# Altium schematic sheet MachNguyenLy.SchDoc
size A2
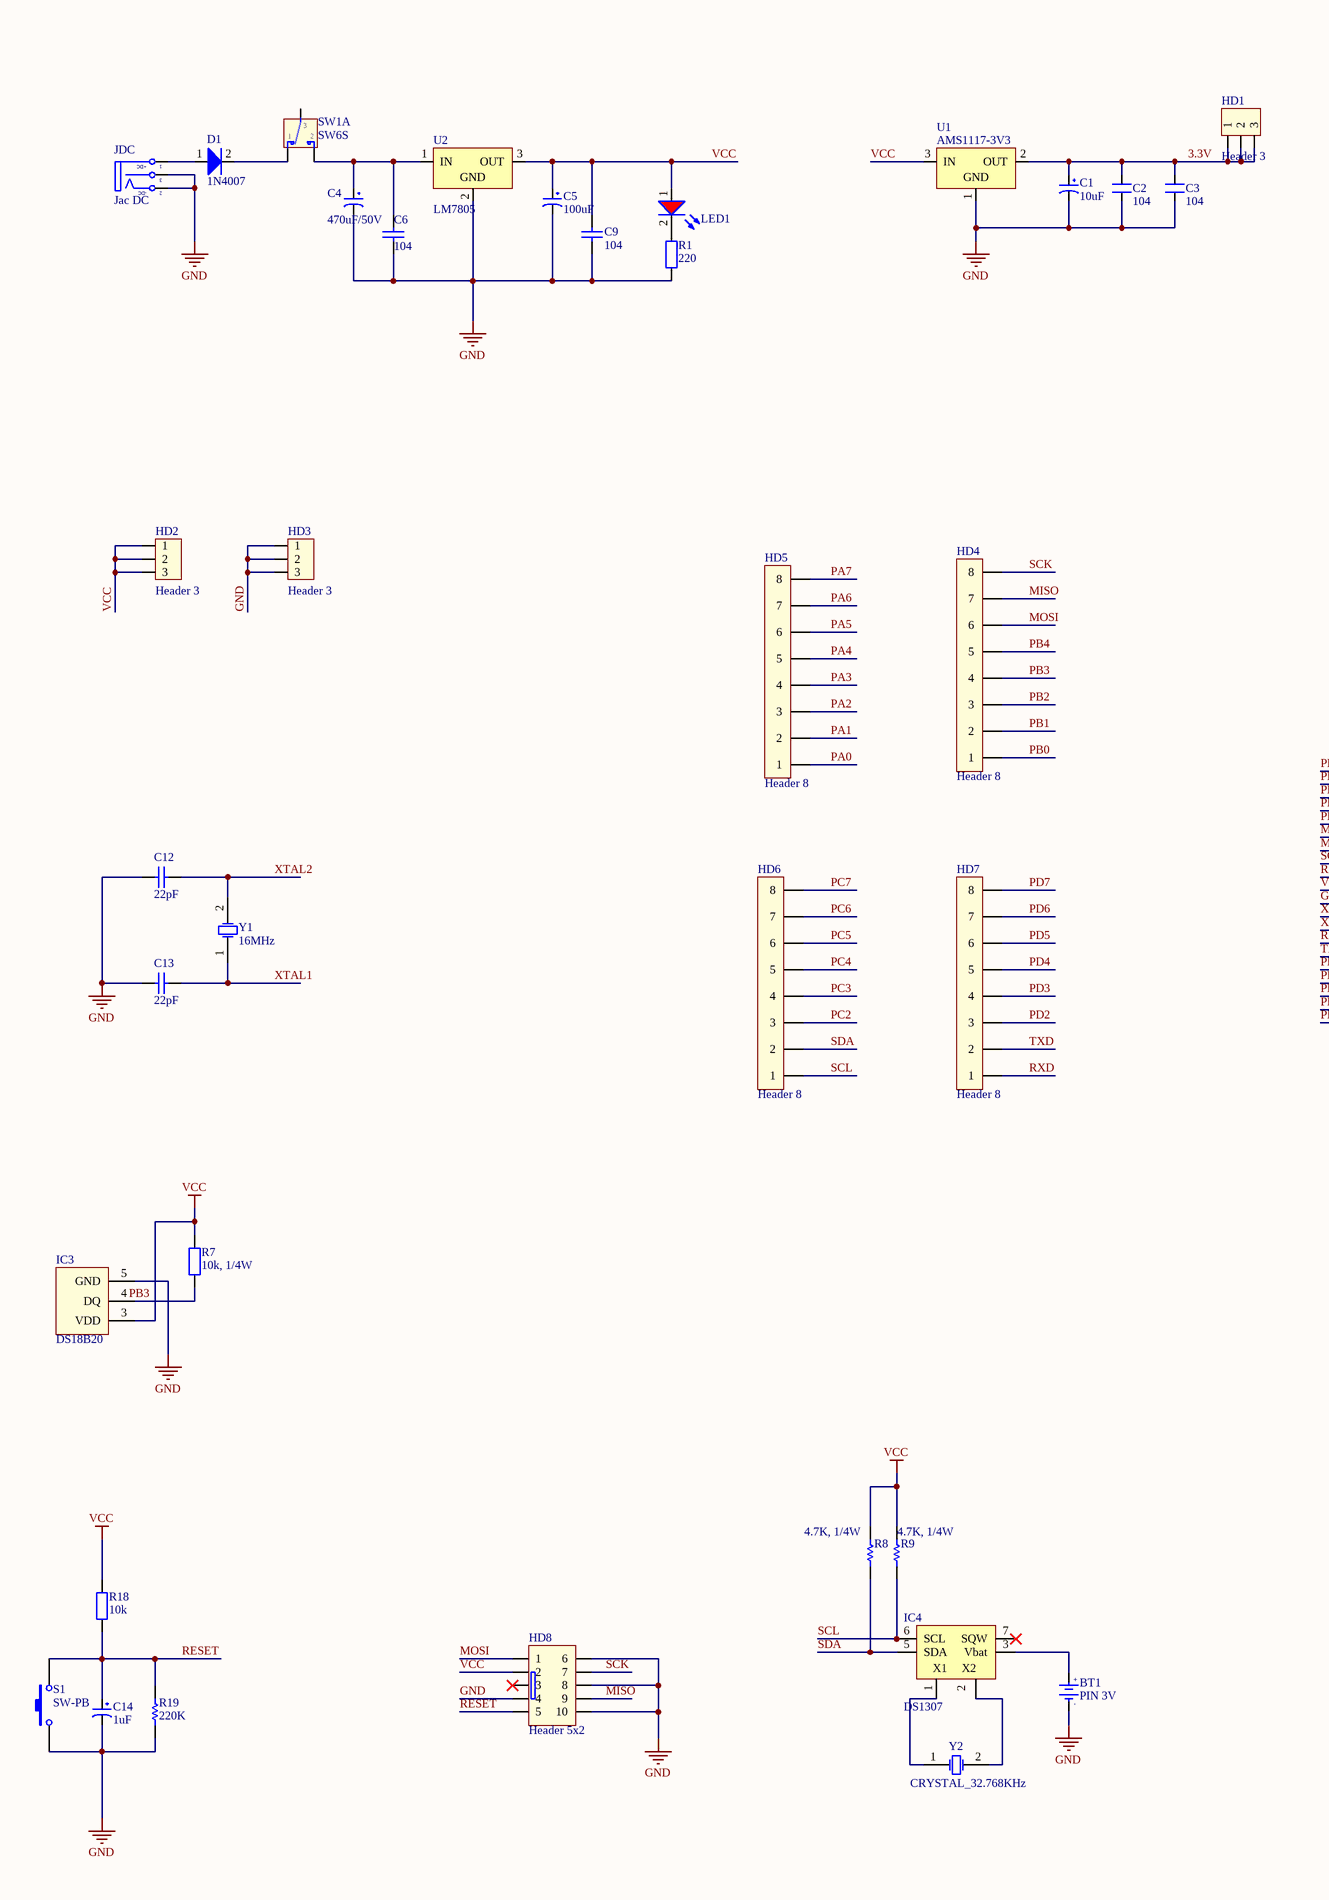
[diagram p0: MachNguyenLy.SchDoc, left]
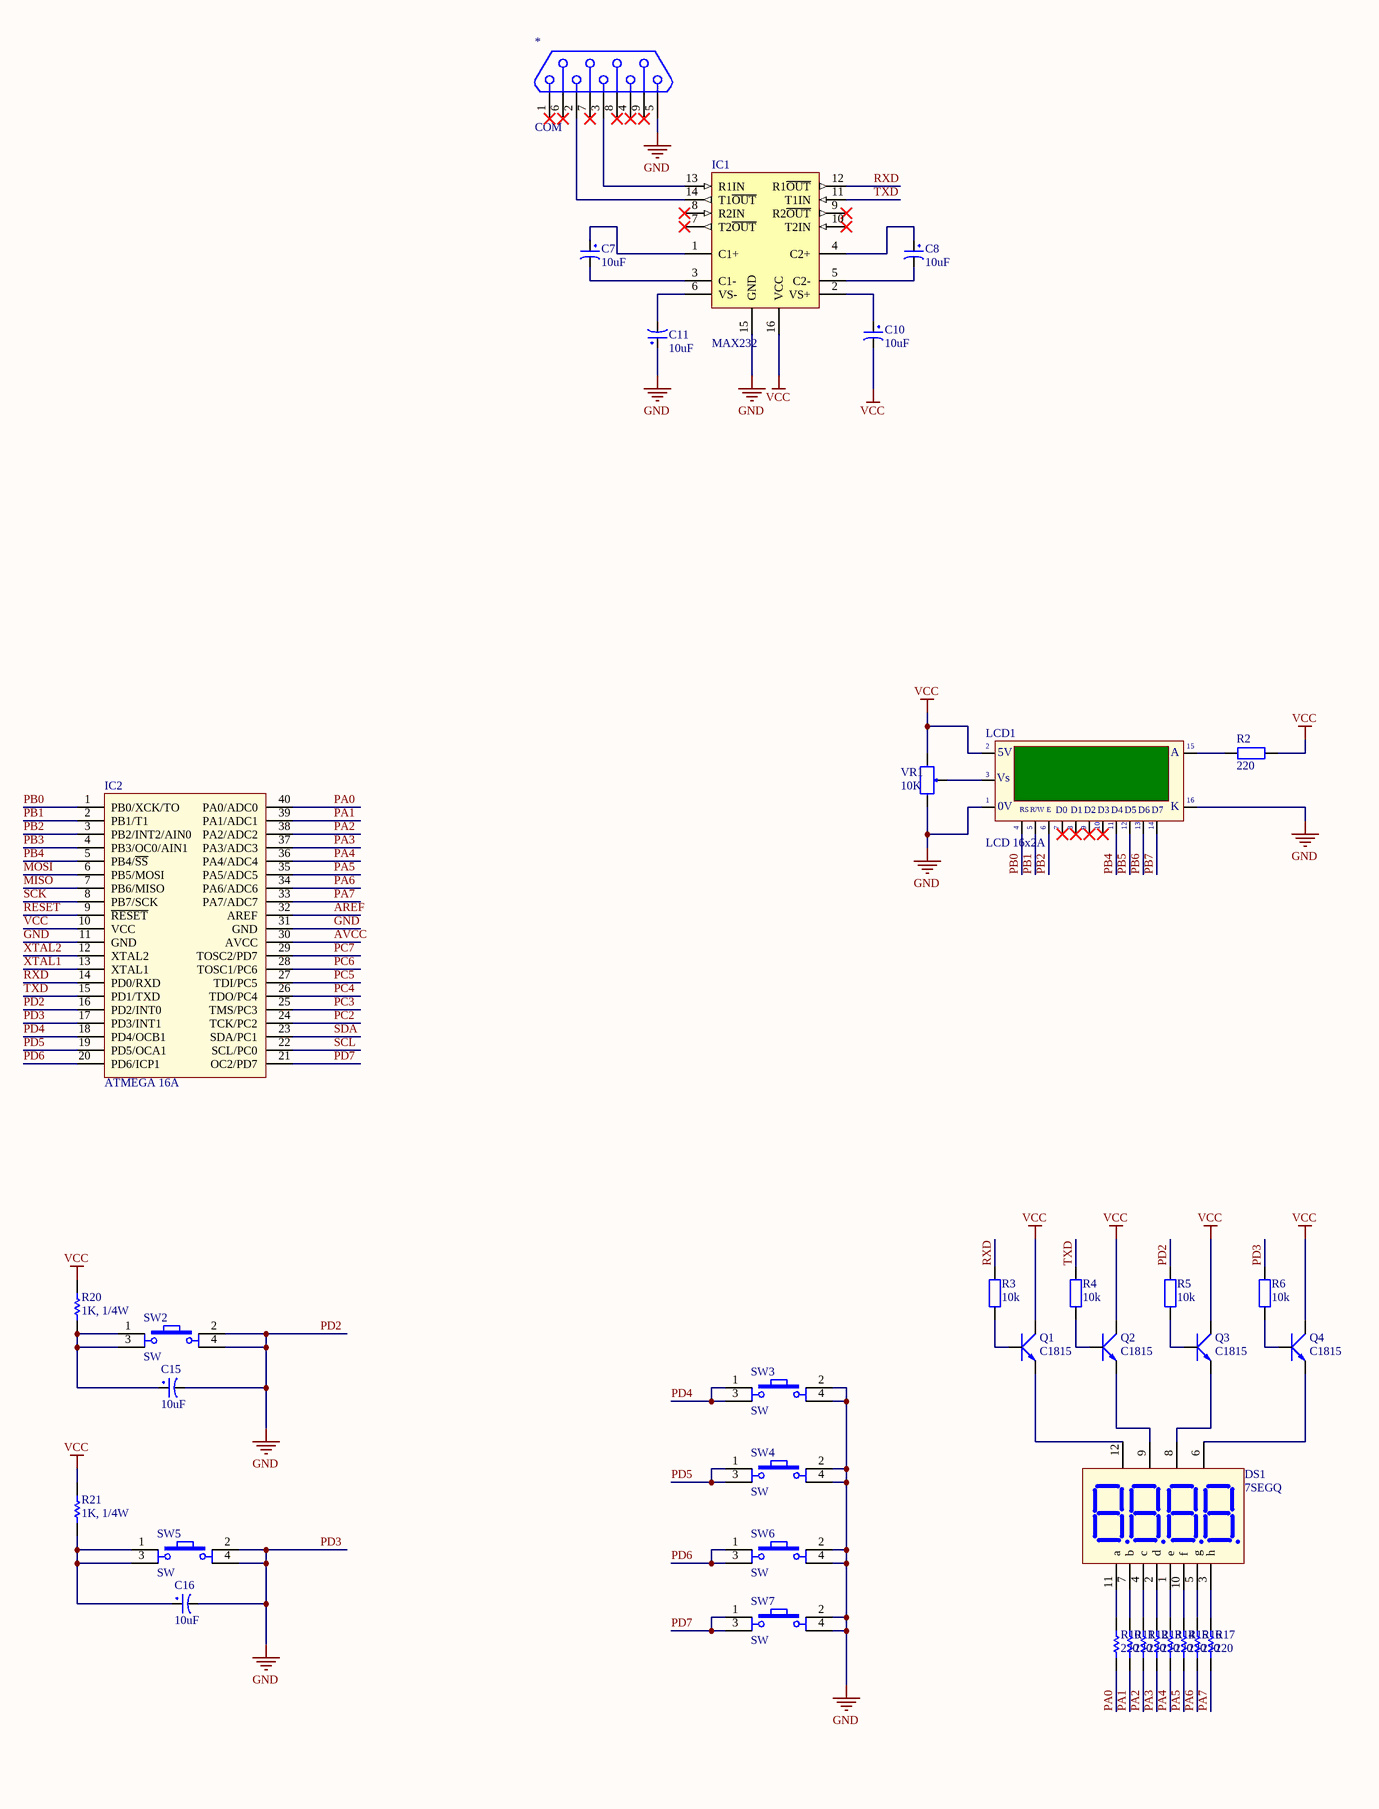
[diagram p1: MachNguyenLy.SchDoc, right]

## Parts
*  COM  [DSB 9-F FIX]
BT1  PIN 3V  [BS_3_Battery_holder]
C1  10uF  [CAP_10UF_16V]
C2  104  [Tu gom 104]
C3  104  [Tu gom 104]
C4  470uF/50V  [CAP_470UF_50V]
C5  100uF  [CAP_100UF_25V]
C6  value 104  [Tu gom 104]  (hidden comment: 5AK102KABAA)
C7  10uF  [CAP_10UF_50V]
C8  10uF  [CAP_10UF_50V]
C9  value 104  [Tu gom 104]  (hidden comment: 5AK102KABAA)
C10  10uF  [CAP_10UF_50V]
C11  10uF  [CAP_10UF_50V]
C12  value 22pF  [Tu 33p]  (hidden comment: 5AK102KABAA)
C13  value 22pF  [Tu 33p]  (hidden comment: 5AK102KABAA)
C14  1uF  [CAP_1UF_50V]
C15  10uF  [CAP_10UF_16V]
C16  10uF  [CAP_10UF_16V]
D1  1N4007  [1N4007]
DS1  7SEGQ  [7SEG_4DIGIT]
HD1  Header 3  [Header_3]
HD2  Header 3  [Header_3]
HD3  Header 3  [Header_3]
HD4  Header 8  [Header_8]
HD5  Header 8  [Header_8]
HD6  Header 8  [Header_8]
HD7  Header 8  [Header_8]
HD8  Header 5x2  [HeaderSP_5x2]
IC1  MAX232  [74HC4017]
IC2  ATMEGA 16A  [PIC16F877A]
IC3  DS18B20  [Header_FM_3]
IC4  DS1307  [DS1307]
JDC  Jac DC  [DC-IN]
LCD1  LCD 16x2A  [LCD16x2]
LED1  LED_R_3  [LED3R]  (value not drawn)
Q1  C1815  [2SA1015]
Q2  C1815  [2SA1015]
Q3  C1815  [2SA1015]
Q4  C1815  [2SA1015]
R1  220  [RES 1/4W CFR25]
R2  220  [RES 1/4W CFR25]
R3  10k  [RES 1/4W CFR25]
R4  10k  [RES 1/4W CFR25]
R5  10k  [RES 1/4W CFR25]
R6  10k  [RES 1/4W CFR25]
R7  10k, 1/4W  [RES 1/4W CFR25]
R8  value 4.7K, 1/4W  [RES 1/4W CFR25]  (hidden comment: CF1/4W1KJ25)
R9  value 4.7K, 1/4W  [AXIAL-0.3]  (hidden comment: CF1/4W1KJ25)
R10  value 220  [AXIAL-0.3]  (hidden comment: CF1/4W1KJ25)
R11  value 220  [AXIAL-0.3]  (hidden comment: CF1/4W1KJ25)
R12  value 220  [AXIAL-0.3]  (hidden comment: CF1/4W1KJ25)
R13  value 220  [AXIAL-0.3]  (hidden comment: CF1/4W1KJ25)
R14  value 220  [AXIAL-0.3]  (hidden comment: CF1/4W1KJ25)
R15  value 220  [AXIAL-0.3]  (hidden comment: CF1/4W1KJ25)
R16  value 220  [AXIAL-0.3]  (hidden comment: CF1/4W1KJ25)
R17  value 220  [AXIAL-0.3]  (hidden comment: CF1/4W1KJ25)
R18  10k  [RES 1/4W CFR25]
R19  value 220K  [RES 1/4W CFR25]  (hidden comment: CF1/4W220KJ25)
R20  value 1K, 1/4W  [RES 1/4W CFR25]  (hidden comment: CF1/4W1KJ25)
R21  value 1K, 1/4W  [RES 1/4W CFR25]  (hidden comment: CF1/4W1KJ25)
S1  SW-PB  [SPST-2]
SW1  SW6S  [SMD_DIP_Switch1]  (part A of 2)
SW2  SW  [BUTTON 4 PIN]
SW3  SW  [BUTTON 4 PIN]
SW4  SW  [BUTTON 4 PIN]
SW5  SW  [BUTTON 4 PIN]
SW6  SW  [BUTTON 4 PIN]
SW7  SW  [BUTTON 4 PIN]
U1  AMS1117-3V3  [AMS1117-3.3V]
U2  LM7805  [LM7805]
VR1  10K  [VR1]
Y1  16MHz  [CRYSTAL]
Y2  CRYSTAL_32.768KHz  [CRYSTAL]

## Nets
GND: *.5 BT1.2(GND) C1.2 C2.1 C3.1 C4.2 C5.2 C6.1 C9.1 C11.1 C12.1 C13.1 C14.2 C15.2 C16.2 HD3.1 HD3.2 HD3.3 HD7.3 HD7.4 HD8.4 HD8.6 HD8.8 HD8.10 IC1.15(GND) IC2.11(GND) IC2.16(PD2/INT0) IC2.17(PD3/INT1) IC2.31(GND) IC3.5(GND) IC4.4(GND) JDC.2(TN) JDC.3(S) LCD1.1(GND) LCD1.16(K) R1.1 R5.2 R6.2 R19.1 S1.1 SW2.2 SW2.4 SW3.2 SW3.4 SW4.2 SW4.4 SW5.2 SW5.4 SW6.2 SW6.4 SW7.2 SW7.4 U1.1(GND) U2.2(GND) VR1.3  [also labelled PD2, PD3]
VCC: C5.1 C9.2 C10.2 HD2.1 HD2.2 HD2.3 HD8.2 IC1.16(VCC) IC2.10(VCC) IC3.3(VDD) IC4.8(VCC) LCD1.2(VDD) LED1.1(A) Q1.2(C) Q2.2(C) Q3.2(C) Q4.2(C) R2.2 R7.2 R8.2 R9.2 R18.2 R20.2 R21.2 U1.3(IN) U2.3(OUT) VR1.1
3.3V: C1.1 C2.2 C3.2 HD1.1 HD1.2 HD1.3 U1.2(OUT)
AREF: IC2.32(AREF)
AVCC: IC2.30(AVCC)
MISO: HD4.7 HD8.9 IC2.7(PB6/MISO)
MOSI: HD4.6 HD8.1 IC2.6(PB5/MOSI)
PA0: HD5.1 IC2.40(PA0/ADC0) R10.1
PA1: HD5.2 IC2.39(PA1/ADC1) R11.1
PA2: HD5.3 IC2.38(PA2/ADC2) R12.1
PA3: HD5.4 IC2.37(PA3/ADC3) R13.1
PA4: HD5.5 IC2.36(PA4/ADC4) R14.1
PA5: HD5.6 IC2.35(PA5/ADC5) R15.1
PA6: HD5.7 IC2.34(PA6/ADC6) R16.1
PA7: HD5.8 IC2.33(PA7/ADC7) R17.1
PB0: HD4.1 IC2.1(PB0/XCK/TO) LCD1.4(RS)
PB1: HD4.2 IC2.2(PB1/T1) LCD1.5(R/~{W})
PB2: HD4.3 IC2.3(PB2/INT2/AIN0) LCD1.6(~{EN})
PB3: HD4.4 IC2.4(PB3/OC0/AIN1)
PB4: HD4.5 IC2.5(PB4/~{SS}) LCD1.11(D4)
PB5: LCD1.12(D5)
PB6: LCD1.13(D6)
PB7: LCD1.14(D7)
PC2: HD6.3 IC2.24(TCK/PC2)
PC3: HD6.4 IC2.25(TMS/PC3)
PC4: HD6.5 IC2.26(TDO/PC4)
PC5: HD6.6 IC2.27(TDI/PC5)
PC6: HD6.7 IC2.28(TOSC1/PC6)
PC7: HD6.8 IC2.29(TOSC2/PD7)
PD4: HD7.5 IC2.18(PD4/OCB1) SW3.1 SW3.3
PD5: HD7.6 IC2.19(PD5/OCA1) SW4.1 SW4.3
PD6: HD7.7 IC2.20(PD6/ICP1) SW6.1 SW6.3
PD7: HD7.8 IC2.21(OC2/PD7) SW7.1 SW7.3
RESET: C14.1 HD8.5 IC2.9(~{RESET}) R18.1 R19.2 S1.2
RXD: HD7.1 IC1.12(R1~{OUT}) IC2.14(PD0/RXD) R3.2
SCK: HD4.8 HD8.7 IC2.8(PB7/SCK)
SCL: HD6.1 IC2.22(SCL/PC0) IC4.6(SCL) R9.1
SDA: HD6.2 IC2.23(SDA/PC1) IC4.5(SDA) R8.1
TXD: HD7.2 IC1.11(T1IN) IC2.15(PD1/TXD) R4.2
XTAL1: C13.2 IC2.13(XTAL1) Y1.1(OSC1)
XTAL2: C12.2 IC2.12(XTAL2) Y1.2(OSC2)
Net*_2: *.2 IC1.14(T1~{OUT})
Net*_3: *.3 IC1.13(R1IN)
NetBT1_1: BT1.1(+3V) IC4.3(Vbat)
NetC4_1: C4.1 C6.2 SW1.2 U2.1(IN)
NetC7_1: C7.1 IC1.1(C1+)
NetC7_2: C7.2 IC1.3(C1-)
NetC8_1: C8.1 IC1.4(C2+)
NetC8_2: C8.2 IC1.5(C2-)
NetC10_1: C10.1 IC1.2(VS+)
NetC11_2: C11.2 IC1.6(VS-)
NetC15_1: C15.1 R20.1 SW2.1 SW2.3
NetC16_1: C16.1 R21.1 SW5.1 SW5.3
NetD1_1: D1.1(A) JDC.1(T)
NetD1_2: D1.2(K) SW1.1
NetDS1_1: DS1.1(e) R14.2
NetDS1_2: DS1.2(d) R13.2
NetDS1_3: DS1.3(h) R17.2
NetDS1_4: DS1.4(c) R12.2
NetDS1_5: DS1.5(g) R16.2
NetDS1_6: DS1.6(V4) Q4.1(E)
NetDS1_7: DS1.7(b) R11.2
NetDS1_8: DS1.8(V3) Q3.1(E)
NetDS1_9: DS1.9(V2) Q2.1(E)
NetDS1_10: DS1.10(f) R15.2
NetDS1_11: DS1.11(a) R10.2
NetDS1_12: DS1.12(V1) Q1.1(E)
NetIC3_4: IC3.4(DQ) R7.1
NetIC4_1: IC4.1(X1) Y2.1(OSC1)
NetIC4_2: IC4.2(X2) Y2.2(OSC2)
NetLCD1_3: LCD1.3(VEE) VR1.2
NetLCD1_15: LCD1.15(A) R2.1
NetLED1_2: LED1.2(K) R1.2
NetQ1_3: Q1.3(B) R3.1
NetQ2_3: Q2.3(B) R4.1
NetQ3_3: Q3.3(B) R5.1
NetQ4_3: Q4.3(B) R6.1

Not connected (* = marked no-connect by the designer): * 1* 4* 6* 7* 8* 9*; HD8 3*; IC1 7(T2~{OUT})* 8(R2IN)* 9(R2~{OUT})* 10(T2IN)*; IC4 7(SQW)*; LCD1 7(D0)* 8(D1)* 9(D2)* 10(D3)*; SW1 3; U1 4(OUT)

## Notes on the sheet
- Labels drawn without touching a wire or pin: PB3
- (in symbol DCIN) +DC; -DC
- (in symbol LCD16x2A) 5V; Vs; |; 0V; R/W; E
- (in symbol PIN 3V) +; -

## Library data of the parts
BT1 = PIN 3V: Battery 3VDC; Value: PIN 3V
C1 C7 C8 C10 C11 C14-C16 = CP1: Cap P  0,1uF < 22uF , 16 - 50V; Value: 10uF/50V; Description 1: 10 => 220uF/6,3V/10V - 10uF => 100uF/16V; Description 2: 0,1uF => 33uF/50V - 10uF => 22uF/63V; Description 3: 0,47uF => 10uF/100V
C2 C3 = CN2: Cap np 104 => 105pF; Value: 0.1uF
C4 = CP8: Cap 4700uF/50V; Value: 220uF/450V
C5 = CP2: C 47uF/50V , 220uF/16V; Value: 47uF/16 - 50V; Description 1: 470uF/6,3V - 330uF/10V - 220uF/16V; Description 2: 100uF/25V - 35V - 47uF/50V - 22uF/100V; Description 3: 33uF => 47uF/63V - 1uF => 4,7uF/160V; Description 4: 1uF => 2,2uF/250V - 1uF/350V
C6 C9 C12 C13 = 5AK102KABAA: CAP NPO CAPNTO 1nF 100V 10%; ComponentLink1Description: Datasheet; ComponentLink1URL: D:\Dropbox\Datasheets\Passive Components\Capacitors\AVX Disc Ceramic Capacitors.pdf; Unit Price: 0.003
D1 = 1N4007: Diode LS 1A 1000V DO-41; ComponentLink1Description: Datasheet; ComponentLink1URL: D:\Dropbox\Datasheets\Diodes and Rectifiers\Diodes\1N400X.pdf; Unit Price: 0.0072
DS1 = LED7Q: Four 7 Seg Dipslay; Value: LED 7Q SEG
HD1-HD3 = Hed3: Header 3 (Green); Value: Header 3
HD4-HD7 = HED8V: Header 8 Vit Broad
HD8 = HED5x2: Value: Header 5x2
IC1 = MAX232: Dual EIA-232 Driver/Receiver; Value: MAX232
IC2 = Atmega16L: 8-Bit AVR Microcontroller with 16K Bytes of In-System Programmable Flash Memory; Value: Atmega 16L
IC3 = DS18S20: High Precision  1-Wire® Digital Thermometer
IC4 = DS1307: Real Timer Serial; Value: DS1307
JDC = DCIN: Jac DC input; Value: Jac DC
LCD1 = LCD16x2A: LCD dipslay 16 char, 2 line; Value: LCD16x2A
LED1 = LED_RED_3MM: LED Red 3mm; ComponentLink1Description: Datasheet; ComponentLink1URL: D:\Dropbox\Datasheets\Opto and Illumination\LEDs\SMD LED.pdf; Unit Price: 0.0476
Q1-Q4 = C1815: NPN 600mW, ECB; Value: C1815
R1-R7 R18 = R1/4W: Resistor 1/4W; Value: R1/4W - 1K
R8-R17 R20 R21 = CF1/4W1KJ25: RES CF AXIAL-0.3 5% 1/4W 1K; Unit Price: 0.001; ComponentLink1Description: Datasheet; ComponentLink1URL: D:\Dropbox\Datasheets\Passive Components\Resistors\Carbon Film Resistor.pdf
R19 = CF1/4W220KJ25: RES CF AXIAL-0.3 5% 1/4W 220K; Unit Price: 0.001; ComponentLink1Description: Datasheet; ComponentLink1URL: D:\Dropbox\Datasheets\Passive Components\Resistors\Carbon Film Resistor.pdf
S1 = SW-PB: Switch; Published: 24-Mar-1999; LatestRevisionDate: 17-Jul-2002; LatestRevisionNote: Re-released for DXP Platform.; PackageReference: SPST-2; Publisher: Altium Limited; PackageDescription: Switch; 2 Leads
SW1 = SW6S: SW-DTDP - 6 Pin; Value: SW6
SW2-SW7 = SW4: Switch button 4 pin; Value: Button chip 4 pin
U1 = AMS1117-3V3: Linear Voltage Regulator 3.3V 1A 15V Max SOT-223; ComponentLink1Description: Datasheet; ComponentLink1URL: D:\Dropbox\Datasheets\Power Management ICs\Linear Regulators\AMS1117.pdf; Unit Price: 0.2000
U2 = LM7805: Linear Voltage Regulator 5V 1A 24V Max TO-220; ComponentLink1Description: Datasheet; ComponentLink1URL: D:\Dropbox\Datasheets\Power Management ICs\Linear Regulators\LM78XX.pdf; Unit Price: 0.3000
VR1 = VR: Var Resistor; Value: VR 10K
Y1 Y2 = XTAL_12MHz: Crystal Oscillator; Published: 8-Jun-2000; LatestRevisionDate: 17-Jul-2002; LatestRevisionNote: Re-released for DXP Platform.; PackageReference: R38; Publisher: Altium Limited; PackageDescription: Crystal, Thru-Hole; 2 Leads; Body 3.1 x 8.2 mm (Dia.xH)